# Altium schematic sheet DRV8301.SchDoc
size A4
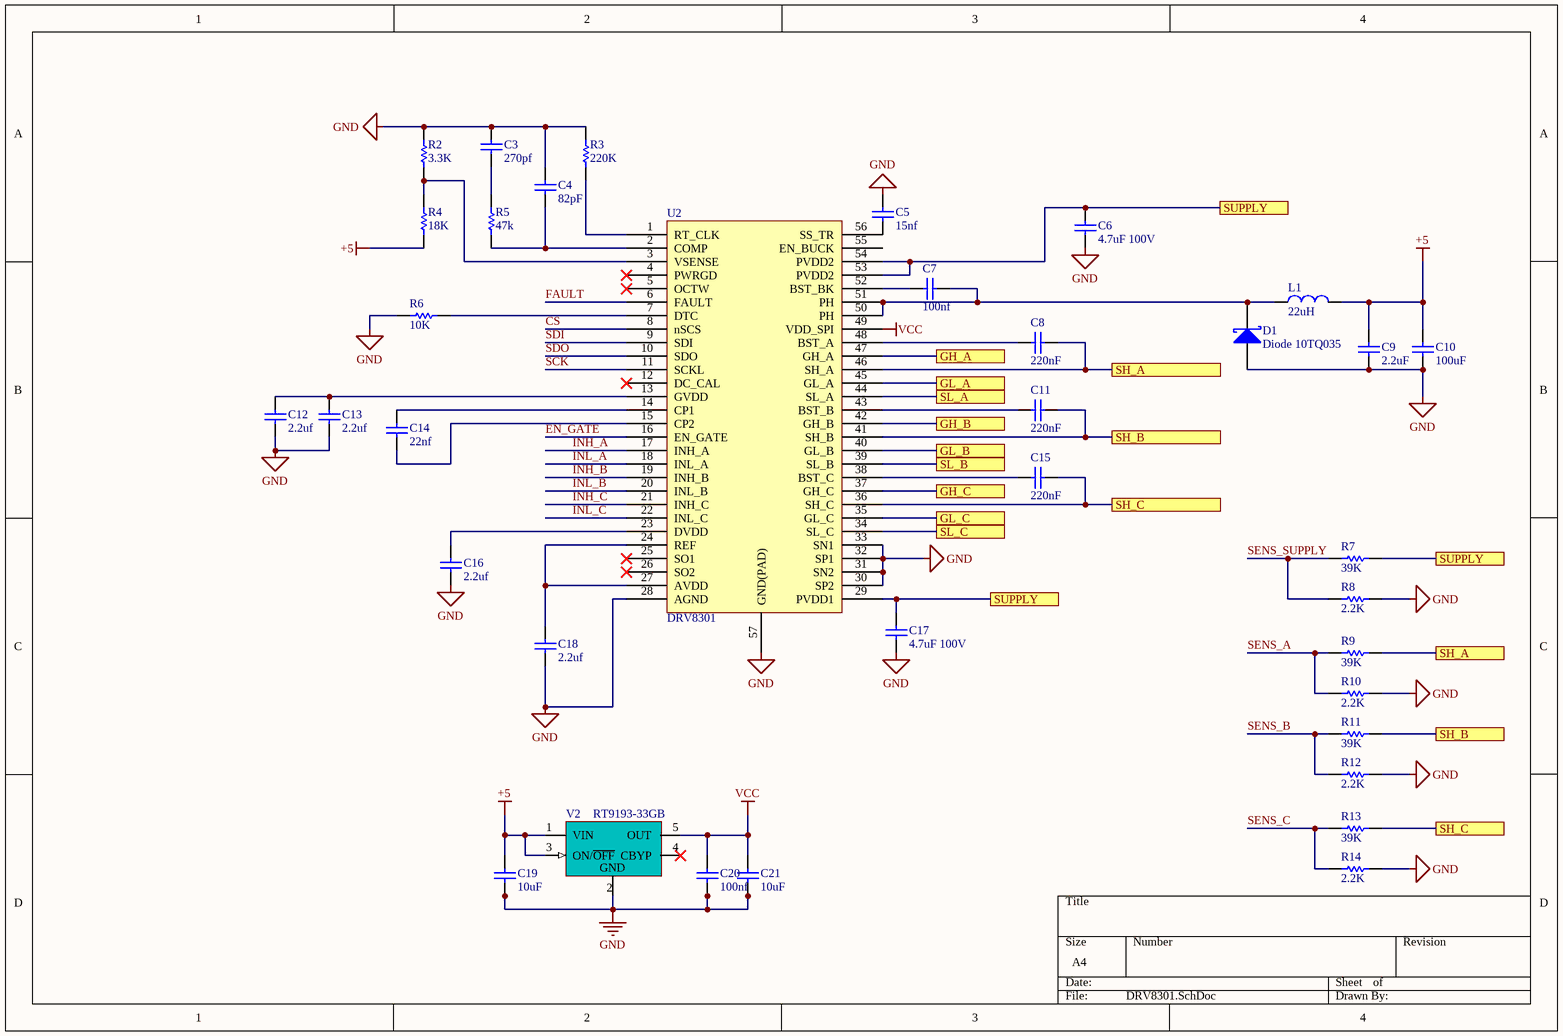
[diagram p0: DRV8301.SchDoc]

## Parts
C3  270pf  [0603-1]
C4  82pF  [0603-1]
C5  15nf  [0603-1]
C6  4.7uF 100V  [0603-1]
C7  100nf  [0603-1]
C8  220nF  [0603-1]
C9  2.2uF  [0603-1]
C10  100uF  [0603-1]
C11  220nF  [0603-1]
C12  2.2uf  [0603-1]
C13  2.2uf  [0603-1]
C14  22nf  [0603-1]
C15  220nF  [0603-1]
C16  2.2uf  [0603-1]
C17  4.7uF 100V  [1206]
C18  2.2uf  [0603-1]
C19  10uF  [0805-1]
C20  100nf  [0603-1]
C21  10uF  [0805-1]
D1  Diode 10TQ035  [LC-SMA(DO-214AC)_S1]
L1  22uH  [L-SMD-7]
R2  3.3K  [0603-1]
R3  220K  [0603-1]
R4  18K  [0603-1]
R5  47k  [0603-1]
R6  10K  [0603-1]
R7  39K  [0603-1]
R8  2.2K  [0603-1]
R9  39K  [0603-1]
R10  2.2K  [0603-1]
R11  39K  [0603-1]
R12  2.2K  [0603-1]
R13  39K  [0603-1]
R14  2.2K  [0603-1]
U2  DRV8301  [DRV8301]
V2  RT9193-33GB  [SOT23-5]

## Ports
GH_A, GH_B, GH_C, GL_A, GL_B, GL_C, SH_A, SH_B, SH_C, SL_A, SL_B, SL_C, SUPPLY

## Nets
+5: C9.1 C10.1 C19.2 L1.2 R4.1 V2.1(VIN) V2.3(ON/~{OFF})
GND: C3.2 C4.2 C5.2 C6.2 C9.2 C10.2 C12.1 C13.1 C16.1 C17.1 C18.1 C19.1 C20.1 C21.1 D1.2(A) R2.2 R3.2 R6.2 R8.1 R10.1 R12.1 R14.1 U2.28(AGND) U2.30(SP2) U2.31(SN2) U2.32(SP1) U2.33(SN1) U2.57(GND(PAD)) V2.2(GND)
VCC: C20.2 C21.2 U2.49(VDD_SPI) V2.5(OUT)
CS: U2.8(nSCS)
EN_GATE: U2.16(EN_GATE)
FAULT: U2.6(FAULT)
GH_A: U2.47(GH_A) ; port GH_A
GH_B: U2.42(GH_B) ; port GH_B
GH_C: U2.37(GH_C) ; port GH_C
GL_A: U2.45(GL_A) ; port GL_A
GL_B: U2.40(GL_B) ; port GL_B
GL_C: U2.35(GL_C) ; port GL_C
INH_A: U2.17(INH_A)
INH_B: U2.19(INH_B)
INH_C: U2.21(INH_C)
INL_A: U2.18(INL_A)
INL_B: U2.20(INL_B)
INL_C: U2.22(INL_C)
SCK: U2.11(SCKL)
SDI: U2.9(SDI)
SDO: U2.10(SDO)
SENS_A: R9.2 R10.2
SENS_B: R11.2 R12.2
SENS_C: R13.2 R14.2
SENS_SUPPLY: R7.2 R8.2
SH_A: C8.1 R9.1 U2.46(SH_A) ; port SH_A
SH_B: C11.1 R11.1 U2.41(SH_B) ; port SH_B
SH_C: C15.1 R13.1 U2.36(SH_C) ; port SH_C
SL_A: U2.44(SL_A) ; port SL_A
SL_B: U2.39(SL_B) ; port SL_B
SL_C: U2.34(SL_C) ; port SL_C
SUPPLY: C6.1 C17.2 R7.1 U2.29(PVDD1) U2.53(PVDD2) U2.54(PVDD2) ; port SUPPLY
NetC3_1: C3.1 R5.2
NetC4_1: C4.1 R5.1 U2.2(COMP)
NetC5_1: C5.1 U2.56(SS_TR)
NetC7_1: C7.1 D1.1(K) L1.1 U2.50(PH) U2.51(PH)
NetC7_2: C7.2 U2.52(BST_BK)
NetC8_2: C8.2 U2.48(BST_A)
NetC11_2: C11.2 U2.43(BST_B)
NetC12_2: C12.2 C13.2 U2.13(GVDD)
NetC14_1: C14.1 U2.15(CP2)
NetC14_2: C14.2 U2.14(CP1)
NetC15_2: C15.2 U2.38(BST_C)
NetC16_2: C16.2 U2.23(DVDD)
NetC18_2: C18.2 U2.24(REF) U2.27(AVDD)
NetR2_1: R2.1 R4.2 U2.3(VSENSE)
NetR3_1: R3.1 U2.1(RT_CLK)
NetR6_1: R6.1 U2.7(DTC)

Not connected (* = marked no-connect by the designer): U2 4(PWRGD)* 5(OCTW)* 12(DC_CAL)* 25(SO1)* 26(SO2)* 55(EN_BUCK); V2 4(CBYP)*

## Library data of the parts
C3-C21 = CAP: Capacitor; Value: 104; Published: 8-Jun-2000; LatestRevisionDate: 17-Jul-2002; LatestRevisionNote: Re-released for DXP Platform.; PackageReference: RAD-0.3; Publisher: Altium Limited
D1 = Diode 10TQ035: Schottky Rectifier; Note: Terminal 2 is the TAB and is electrically connected to the cathode; Published: 8-Jun-2000; LatestRevisionDate: 17-Jul-2002; LatestRevisionNote: Re-released for DXP Platform.; DatasheetVersion: PD-2.057B; PackageVersion: Feb-1998; PackageReference: TO-220AC; Publisher: Altium Limited; PackageDescription: TO, Thru-Hole, Vertical, Heatsink Mounted; 3 In-Line Leads (1 Absent); Pitch 2.54 mm; ComponentLink1Description: Manufacturer Link; ComponentLink1URL: http://www.irf.com/; ComponentLink2Description: Datasheet; ComponentLink2URL: http://www.irf.com/product-info/datasheets/data/10tq.pdf
L1 = L_Inductance
R2-R14 = RES: Resistor; Value: 1K; Published: 8-Jun-2000; Revision: July-2002: Re-released for DXP Platform.; Publisher: Altium Limited
V2 = LP2985-3.3: 3.3V 300mA LDO Regulator,SOT-23-5; Manufacturer: National Semiconductor; Manufacturer Part Number: LP2992AIM5-3.3/NOPB; Description: IC REG LDO MICRPWR 250MA SOT23-5; Regulator Topology: Positive Fixed; Voltage - Input: Up to 16V; Voltage - Dropout (Typical): 0.45V @ 250mA; Number of Regulators: 1; Current - Output: 250mA; Supplier 1: Digi-Key; Supplier Part Number 1: LP2992AIM5-3.3CT-ND; RoHS: RoHS Compliant; Category: Integrated Circuits (ICs); Stock 1: 15821; Pricing 1: 1=1.86, 25=1.4712, 100=1.3239, 250=1.15224, 500=1.02966 (AUD); Voltage - Output: 3.3V; Current - Limit (Min): -; Operating Temperature: -40°C ~ 125°C; Mounting Type: Surface Mount; Package / Case: SC-74A, SOT-753; Supplier Device Package: SOT-23-5; Packaging: Cut Tape (CT); ComponentLink1URL: http://www.national.com/ds/LP/LP2992.pdf; ComponentLink1Description: http://www.national.com/ds/LP/LP2992.pdf